# Altium project Audio_Moduloop_V2.PrjPcb
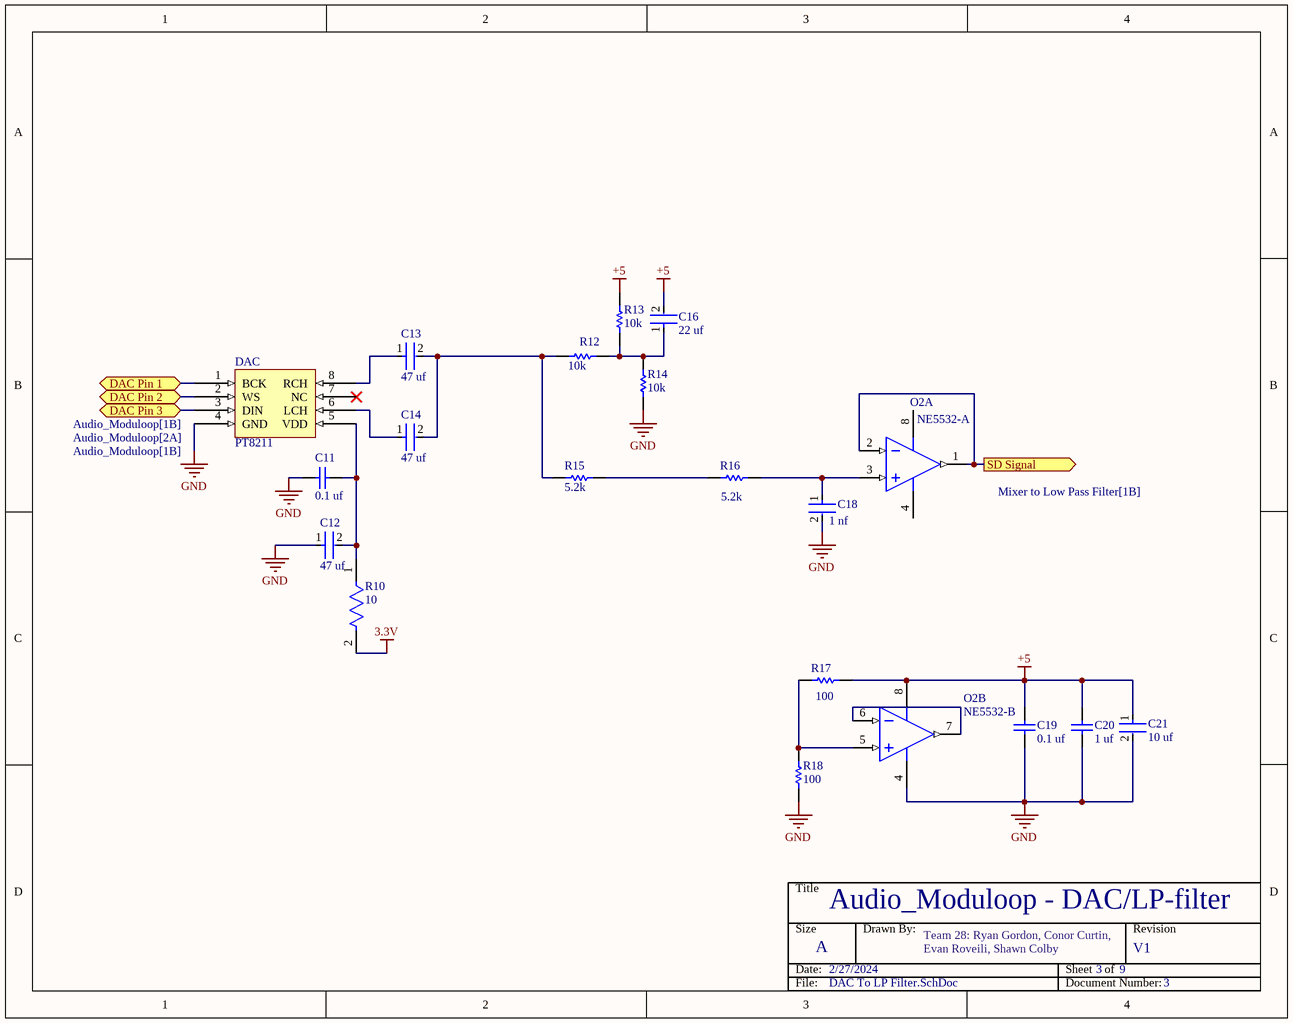
[diagram p0: DAC To LP Filter.SchDoc]
5 sheets, 83 parts. Net scope: flat (ports and power ports of the same name join across sheets).
Board file: Audio_PCB.PcbDoc
Sheets:
  DAC To LP Filter.SchDoc
  Mixer to Low Pass Filter.SchDoc
  High Pass Filter.SchDoc
  Amplifier-LM386.SchDoc
  Amplifier-TPA2016D2.SchDoc

## Sheet DAC To LP Filter.SchDoc: Audio_Moduloop - DAC/LP-filter
size A; Date: 2/27/2024; DrawnBy: Team 28: Ryan Gordon, Conor Curtin, Evan Roveili, Shawn Colby; DocumentNumber: 3; Revision: V1; SheetNumber: 3; SheetTotal: 9

### Parts
C11  0.1 uf  [VISH-K104K15X7RF5TL2]
C12  47 uf  [FP-RCE2A2-MFG]
C13  47 uf  [FP-RCE2A2-MFG]
C14  47 uf  [FP-RCE2A2-MFG]
C16  22 uf  [FP-RCEWM1-MFG]
C18  1 nf  [FP-RCE0DB-MFG]
C19  0.1 uf  [CAPC2013X135X45ML10T25]
C20  1 uf  [CAPC2013X145X50LL20T25]
C21  10 uf  [FP-C0805C-DG-MFG]
DAC  PT8211  [SOIC127P602X173-8N]
O2  NE5532-A  [ONSC-SOIC-8-751-07_V]  (parts A,B of 2)
R10  10  [FP-RN732A-MFG]
R12  10k  [RESC2013X60X35NL10T20]
R13  10k  [RESC2013X60X35NL10T20]
R14  10k  [RESC2013X60X35NL10T20]
R15  5.2k  [RESC2013X70X40LL20T20]
R16  5.2k  [RESC2013X70X40LL20T20]
R17  100  [RESC2013X60X40ML20T25]
R18  100  [RESC2013X60X40ML20T25]

### Ports
DAC Pin 1 (bidir, see Audio_Moduloop[1B]), DAC Pin 2 (bidir, see Audio_Moduloop[1B]), DAC Pin 3 (bidir, see Audio_Moduloop[2A]), SD Signal (out, see Mixer to Low Pass Filter[1B])

### Nets
3.3V: R10.2
+5: C16.2 C19.1 C20.1 C21.1 O2.8(V+) R13.1 R17.2
GND: C11.2 C12.1 C18.2 C19.2 C20.2 C21.2 DAC.4(GND) O2.4(V-) R14.2 R18.1
NetC11_1: C11.1 C12.2 DAC.5(VDD) R10.1
NetC13_1: C13.1 DAC.8(RCH)
NetC13_2: C13.2 C14.2 R12.2 R15.1
NetC14_1: C14.1 DAC.6(LCH)
NetC16_1: C16.1 R12.1 R13.2 R14.1
NetC18_1: C18.1 O2.3(INA+) R16.2
NetDAC_1: DAC.1(BCK) ; port DAC Pin 1
NetDAC_2: DAC.2(WS) ; port DAC Pin 2
NetDAC_3: DAC.3(DIN) ; port DAC Pin 3
NetO2_1: O2.1(OUTA) O2.2(INA-) ; port SD Signal
NetO2_5: O2.5(INB+) R17.1 R18.2
NetO2_6: O2.6(INB-) O2.7(OUTB)
NetR15_2: R15.2 R16.1

Not connected (* = marked no-connect by the designer): DAC 7(NC)*

### Notes on the sheet
- Title
- Size
- Date:
- A
- Drawn By:
- Sheet    of
- Revision
- File:
- Document Number:

### Library data of the parts
C11 = CMP-2000-06508-1: Ceramic Capacitor, 100 nF, +/- 10%, 50 V, -55 to 125 degC, 2-Pin THD, RoHS, Tape and Reel; Manufacturer: Vishay; Other Names: BC1084CT; Catalog Drawings: Mono-KapSide2-15_5.58Mono-KapSide1_15; Temperature Coefficient: X7R; Voltage - Rated: 50V; Online Catalog: Mono-Kap™Series; Capacitance: 0.1µF; Size / Dimension: 0.157"Lx0.098"W(4.00mmx2.50mm); Operating Temperature: -55°C~125°C; Family: CeramicCapacitors; Manufacturer URL: http://www.vishay.com/; Standard Package: 1; Thickness (Max): -; Ratings: -; Datasheet Version: 08/2013; Package Description: 2-Pin Through Hole Device, Body 4 x 2.6 mm; Mounting Type: ThroughHole; Features: -; Lead Spacing: 0.098"(2.50mm); Tolerance: ±10%; Category: Capacitors; Mounting Technology: ThroughHole; Lead Style: Straight; Datasheet URL: http://www.vishay.com/docs/45171/kseries.pdf; Applications: GeneralPurpose; Package / Case: Radial; Height - Seated (Max): 0.220"(5.58mm); Package Reference: K104K15X7RF5TL2; Series: Mono-Kap™K; Packaging: CutTape(CT)
C12-C14 = CMP-06035-022497-1: Cap Ceramic 4.7uF 25V X7R ±10% Radial 2.5mm +125°C Automotive Ammo Pack; Lead/Base Style: Straight; Lead Diameter: 0.5mm; Height - Seated (Max): 0.157inch; Voltage Rating (DC): 25V; Height: 4mm; Length: 0.217inch; Max Operating Temperature: 125°C; Ratings: AEC-Q200; Dielectric: X7R; Resistor Type: Ceramic; Packaging: Tape and Reel; Tolerance: 10%; Termination: Radial; Min Operating Temperature: -55°C; Case/Package: Radial; Width: 0.124inch; Lead Pitch: 0.098inch; Package Quantity: 2000; Voltage Rating: 25V; Mount: Through Hole; Capacitance: 4.7uF
C16 = CMP-06035-009422-1: Cap Ceramic 22uF 25V X7R ±20% Radial 5mm +125°C Automotive Ammo Pack; Lead/Base Style: Formed Leads; Lead Diameter: 0.5mm; Packaging: Bulk; Width: 0.157inch; Min Operating Temperature: -55°C; Lead Pitch: 0.197inch; Ratings: AEC-Q200; Length: 0.217inch; Voltage Rating (DC): 25V; Case/Package: Radial; Height - Seated (Max): 0.295inch; Package Quantity: 500; Max Operating Temperature: 125°C; Mount: Through Hole; Resistor Type: Ceramic; Height: 7.5mm; Capacitance: 22uF; Tolerance: 20%; Dielectric: X7R; Voltage Rating: 25V; Termination: Radial
C18 = CMP-06035-009321-1: Cap Ceramic 470pF 100V X7R ±10% Radial 2.5mm +125°C Ammo Pack; Lead Diameter: 0.5mm; Lead/Base Style: Straight; Termination: Radial; Width: 0.098inch; Mount: Through Hole; Package Quantity: 2000; Height - Seated (Max): 0.138inch; Height: 3.5mm; Voltage Rating: 100V; Min Operating Temperature: -55°C; Dielectric: X7R; Max Operating Temperature: 125°C; Voltage Rating (DC): 100V; Capacitance: 470pF; Ratings: AEC-Q200; Packaging: Tape and Reel; Tolerance: 10%; Resistor Type: Ceramic; Lead Pitch: 0.098inch; Case/Package: Radial; Length: 0.142inch
C19 = CMP-2100-03644-1: Chip Capacitor, 0.1 uF, +/- 10%, 50 V, -55 to 125 degC, 0805 (2012 Metric), RoHS, Tape and Reel; Manufacturer: Murata; Voltage: 50V; Capacitance: 100nF; Insulation Resistance: 10GR; Dielectric Material: Ceramic; Dielectric: X7R; Package Description: 2-Pin Surface Mount Device, Body 2 x 1.25 mm; Manufacturer URL: http://www.murata.com/; Case Code (Imperial): 0805; Datasheet URL: http://psearch.en.murata.com/capacitor/product/GRM21BR71H104KA01%23.pdf; Termination: SMD/SMT; Lead Free: LeadFree; Package Quantity: 1; Mount: SurfaceMount; REACH SVHC: Unknown; Thickness: 0.053inch; Height: 1.25mm; Case/Package: 0805; Voltage Rating: 50V; Width: 0.049inch; Case Code (Metric): 2012; Material: Ceramic; Min Operating Temperature: -55degC; RoHSCompliant: true; Datasheet Version: 42675.0; Voltage Rating (DC): 50V; Tolerance: 10%; Package Reference: 0805; Depth: 1.25mm; Length: 2mm; Max Operating Temperature: 125degC; Packaging: TapeandReel; Number of Pins: 2; Radiation Hardening: No
C20 = CMP-1036-04746-2: Manufacturer: Kemet; Part Number: C0805C105K4PACTU
C21 = CMP-2007-03243-2: CAP CER 10UF 10V X5R 0805; Manufacturer Part Number: C0805C106K8PACTU; Manufacturer: Kemet; 3DS Part Number: 220-00001; Tolerance: 10%; Temperature Coefficient: 15%; Material: Ceramic; Device Class L2: Capacitors; Device Class L1: Passive Components; ComponentLink2URL: https://content.kemet.com/datasheets/KEM_C1006_X5R_SMD.pdf; Height: 1.4mm; Lead Free: Yes; Digikey Description: CAP CER 10UF 10V X5R 0805; Octopart: https://octopart.com/c0805c106k8pactu-kemet-98697; Capacitance: 10uF; Value: 10uF; Temperature Range Low: -55°C; Temperature: -55°C to +85°C; Automotive: No; Mouser Description: CAP CER 10UF 10V X5R 0805; Ipc Land Pattern Name: CAPC200125X125; Temperature Range High: +85°C; Voltage: 10V; RoHS: TRUE; Device Class L3: Ceramic Capacitors; ComponentLink2Description: Datasheet; Voltage Rating: 10V; Package: C0805C-DG; Temperature Characteristic: X5R; Category: Cap
DAC = CMP-015-00008-3
O2 = CMP-1310-00252-1: Internally Compensated Dual Low Noise Operational Amplifier, 6 to 40 V, 0 to 70 degC, 8-Pin SOIC, Pb-Free, Tape and Reel; Manufacturer: On Semiconductor; PartNumber: NE5532AD8R2G; SR Typ (V/uS): 9; VCC Min (V): 6; VCC Max (V): 40; GBW Typ (MHz): 10; PackageVersion: Rev. AK, 02/2011; ComponentLink2URL: http://www.onsemi.cn/pub_link/Collateral/NE5532-D.PDF; RoHS: TRUE; PackageReference: SOIC-8-751-07; ComponentLink2Description: Datasheet; PackageDescription: 8-Pin Small Outline Integrated Circuit, Body 4.9 x 3.9 mm, Pitch 1.27 mm; ComponentLink3URL: http://www.onsemi.com/pub_link/Collateral/751-07.PDF; ComponentLink1Description: Manufacturer URL; DatasheetVersion: Rev. 2; Packing: Tape and Reel; ComponentLink1URL: http://www.onsemi.com/; ComponentLink3Description: Package Specification; Mounting Technology: Surface Mount
R10 = CMP-03211-004731-1: SMD Chip Resistor, Thin Film, 10Ω, 100 V, 0805 [2012 Metric], 100 mW, 0.1%, RN73 Series; Manufacturer: TE Connectivity; Manufacturer Part Number: RN73C2A10RBTG; Power Rating: 0.1W; Temperature Coefficient: 10ppm/°C; Voltage Rating: 100V; Device Class L2: Resistors; octopart_url: https://octopart.com/rn73c2a10rbtg-te+connectivity-21412009; Temperature: -55°C to 155°C; Automotive: No; Temperature Range High: 155°C; Device Class L1: Passive Components; Package: RN732A; Value: 10Ω; Lead Free: Yes; Composition: Thin Film; Ipc Land Pattern Name: RESC200125X55; Resistance: 10Ω; RoHS: TRUE; Height: 0.65mm; Series: RN73; Category: Res; ComponentLink2URL: https://www.te.com/commerce/DocumentDelivery/DDEController?Action=showdoc&DocId=Data+Sheet%7F1773270%7FP%7Fpdf%7FEnglish%7FENG_DS_1773270_P.pdf%7F1676162-2; Device Class L3: Chip SMD Resistors; Octopart: https://octopart.com/rn73c2a10rbtg-te+connectivity-21412009; ComponentLink2Description: Datasheet; Temperature Range Low: -55°C; packaging: 250 cut tape length; Tolerance: 0.1%
R12-R14 = CMP-1659-00013-4: Chip Resistor, 10 KOhm, +/- 1%, 0.125 W, -55 to 155 degC, 0805 (2012 Metric), RoHS, Tape and Reel; Manufacturer: Yageo; Voltage Rating: 150 V; Mount: Surface Mount; ComponentLink1Description: Manufacturer URL; ComponentLink2URL: http://www.yageo.com/documents/recent/PYu-RC_Group_51_RoHS_L_04.pdf; Pins: 2; Length: 2 mm; Min Operating Temperature: -55 degC; Height: 0.5 mm; Mounting Technology: Surface Mount; RoHSCompliant: true; REACH SVHC: No SVHC; ComponentLink1URL: http://www.yageo.com/; Max Operating Temperature: 155 degC; PackageReference: 0805; DatasheetVersion: Rev. 4, 02/2016; Package Quantity: 5000; Packaging: Tape and Reel; ComponentLink2Description: Datasheet; PackageDescription: 2-Pin Surface Mounted Device, Body 2 x 1.25 mm
R15 R16 = CMP-2001-00567-1: Manufacturer: Panasonic; Part Number: ERJ6ENF6801V
R17 R18 = CMP-2001-00580-1: Manufacturer: Panasonic; Part Number: ERA6AEB101V

## Sheet Mixer to Low Pass Filter.SchDoc: Audio_Moduloop - Mixer/Filters
size A; Date: 2/27/2024; DrawnBy: Team 28: Ryan Gordon, Conor Curtin, Evan Roveili, Shawn Colby; DocumentNumber: 4; Revision: V1; SheetNumber: 4; SheetTotal: 9
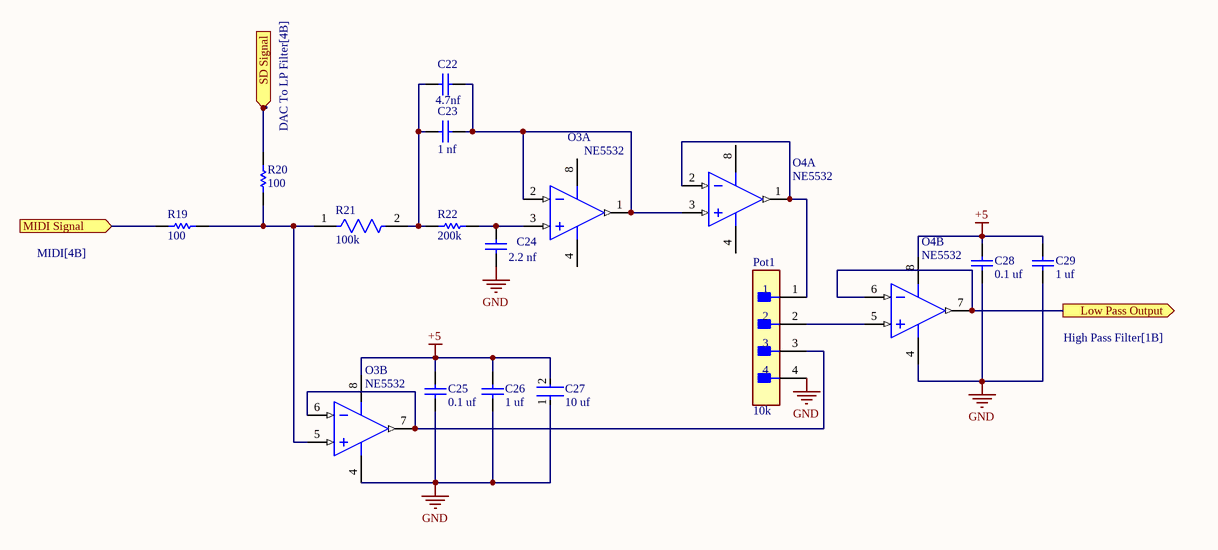
[diagram p1: Mixer to Low Pass Filter.SchDoc]

### Parts
C22  4.7nf  [AVX-SA115C104KAR]
C23  1 nf  [AVX-SA115C104KAR]
C24  2.2 nf  [AVX-SA115C104KAR]
C25  0.1 uf  [CAPC2013X135X45ML10T25]
C26  1 uf  [CAPC2013X145X50LL20T25]
C27  10 uf  [FP-C0805C-DG-MFG]
C28  0.1 uf  [CAPC2013X135X45ML10T25]
C29  1 uf  [CAPC2013X145X50LL20T25]
O3  NE5532  [ONSC-SOIC-8-751-07_V]  (parts A,B of 2)
O4  NE5532  [ONSC-SOIC-8-751-07_V]  (parts A,B of 2)
Pot1  10k  [FP-B4B-XH-A_LF_SN-MFG]
R19  100  [RESC2013X60X40ML20T25]
R20  100  [RESC2013X60X40ML20T25]
R21  100k  [FP-RC0805-0_6-IPC_C]
R22  200k  [RESC2013X60X40LL20T25]

### Ports
Low Pass Output (out, see High Pass Filter[1B]), MIDI Signal (in, see MIDI[4B]), SD Signal (in, see DAC To LP Filter[4B])

### Nets
+5: C25.1 C26.1 C27.2 C28.1 C29.1 O3.8(V+) O4.8(V+)
GND: C24.1 C25.2 C26.2 C27.1 C28.2 C29.2 O3.4(V-) O4.4(V-) Pot1.4
NetC22_1: C22.1 C23.1 R21.2 R22.1
NetC22_2: C22.2 C23.2 O3.1(OUTA) O3.2(INA-) O4.3(INA+)
NetC24_2: C24.2 O3.3(INA+) R22.2
NetC30_2: O4.6(INB-) O4.7(OUTB) ; port Low Pass Output
NetO2_1: R20.1 ; port SD Signal
NetO3_5: O3.5(INB+) R19.2 R20.2 R21.1
NetO3_6: O3.6(INB-) O3.7(OUTB) Pot1.3
NetO4_1: O4.1(OUTA) O4.2(INA-) Pot1.1
NetO4_5: O4.5(INB+) Pot1.2
NetR19_1: R19.1 ; port MIDI Signal

### Notes on the sheet
- Title
- Size
- Date:
- A
- Drawn By:
- Sheet    of
- Revision
- File:
- Document Number:

### Library data of the parts
C22-C24 = CMP-2000-07029-1: Axial Leads / SpinGuard(R), Ceramic Capacitor, 0.10 uF +/- 10%, 50V, -55 to 125 degC, 2-Pin THD, RoHS, Tape and Reel; Manufacturer: AVX; Other Names: 478-3151-1; Catalog Drawings: SASeries_4.32x3.05; Capacitance: 0.1µF; Temperature Coefficient: X7R; Online Catalog: SpinGuard®SASeries; Product Training Modules: ComponentSolutionsforSmartMeterApplications; Category: Capacitors; Package Description: 2-Pin Axial Lead, Dia 3.05 mm, Body Length 4.32 mm; Standard Package: 1; Mounting Technology: ThroughHole; Ratings: -; Datasheet Version: 06/2007; Voltage - Rated: 50V; Tolerance: ±10%; Package Reference: SA115C104KAR; Packaging: -; Lead Style: -; Size / Dimension: 0.120"Diax0.170"L(3.05mmx4.32mm); Mounting Type: ThroughHole; Operating Temperature: -55°C~125°C; Datasheet URL: https://datasheet.ciiva.com/27051/1074183-27051369.pdf; Applications: GeneralPurpose; Thickness (Max): -; Lead Spacing: -; Height - Seated (Max): -; Family: CeramicCapacitors; Package / Case: Axial; Features: -; Series: SpinGuard®SA; Manufacturer URL: http://www.avx.com/
C25 C28 = CMP-2100-03644-1: as C19 on sheet DAC To LP Filter; Package Description: 2-Pin Surface Mount Device, Body 2 x 1.25 mm; Manufacturer URL: http://www.murata.com/; Case Code (Imperial): 0805; Datasheet URL: http://psearch.en.murata.com/capacitor/product/GRM21BR71H104KA01%23.pdf; Termination: SMD/SMT; Lead Free: LeadFree; Package Quantity: 1; Mount: SurfaceMount; REACH SVHC: Unknown; Thickness: 0.053inch; Height: 1.25mm; Case/Package: 0805; Voltage Rating: 50V; Width: 0.049inch; Case Code (Metric): 2012; Material: Ceramic; Min Operating Temperature: -55degC; RoHSCompliant: true; Datasheet Version: 42675.0; Voltage Rating (DC): 50V; Tolerance: 10%; Package Reference: 0805; Depth: 1.25mm; Length: 2mm; Max Operating Temperature: 125degC; Packaging: TapeandReel; Number of Pins: 2; Radiation Hardening: No
C26 C29 = CMP-1036-04746-2: as C20 on sheet DAC To LP Filter
C27 = CMP-2007-03243-2: as C21 on sheet DAC To LP Filter; Device Class L2: Capacitors; Device Class L1: Passive Components; ComponentLink2URL: https://content.kemet.com/datasheets/KEM_C1006_X5R_SMD.pdf; Height: 1.4mm; Lead Free: Yes; Digikey Description: CAP CER 10UF 10V X5R 0805; Octopart: https://octopart.com/c0805c106k8pactu-kemet-98697; Capacitance: 10uF; Value: 10uF; Temperature Range Low: -55°C; Temperature: -55°C to +85°C; Automotive: No; Mouser Description: CAP CER 10UF 10V X5R 0805; Ipc Land Pattern Name: CAPC200125X125; Temperature Range High: +85°C; Voltage: 10V; RoHS: TRUE; Device Class L3: Ceramic Capacitors; ComponentLink2Description: Datasheet; Voltage Rating: 10V; Package: C0805C-DG; Temperature Characteristic: X5R; Category: Cap
O3 O4 = CMP-1310-00252-1: as O2 on sheet DAC To LP Filter; PackageVersion: Rev. AK, 02/2011; ComponentLink2URL: http://www.onsemi.cn/pub_link/Collateral/NE5532-D.PDF; RoHS: TRUE; PackageReference: SOIC-8-751-07; ComponentLink2Description: Datasheet; PackageDescription: 8-Pin Small Outline Integrated Circuit, Body 4.9 x 3.9 mm, Pitch 1.27 mm; ComponentLink3URL: http://www.onsemi.com/pub_link/Collateral/751-07.PDF; ComponentLink1Description: Manufacturer URL; DatasheetVersion: Rev. 2; Packing: Tape and Reel; ComponentLink1URL: http://www.onsemi.com/; ComponentLink3Description: Package Specification; Mounting Technology: Surface Mount
Pot1 = CMP-17439-000250-1: CONN HEADER VERT 4POS 2.5MM; Number of Contacts: 4; Contact Resistance: 20mR; Voltage Rating: 250V; Max Current Rating: 3A; Gender: Male; Wire/Cable Gauge: 22AWG; Mated Stacking Heights: 9.8mm; Insulation Resistance: 1GR; Orientation: Straight; Contact Type: Male Pin; Contact Finish - Mating: TIN; Series: XH; Max Voltage Rating (AC): 250V; Lead Pitch: 2.5mm; Contact Shape: Square; Insulation Color: Natural; Termination: Solder; Lead Free: Lead Free; Voltage Rating (AC): 250V; Number of Rows: 1; Flammability Rating: UL94 V-0; Number of Positions: 4; Max Operating Temperature: 85°C; Package Quantity: 500; Mount: Through Hole; REACH SVHC: No SVHC; Connector Type: Header; Insulation Material: Nylon; Fastening Type: Detent; Min Operating Temperature: -25°C; Housing Color: White; Packaging: Bulk; Contact Plating: Tin; Contact Material: Brass; Max Voltage Rating (DC): 250V; Housing Material: Polyamide; Color: Natural; Material: Polyamide; Pitch: 2.5mm; Depth: 5.75mm; Current Rating: 3A; Length: 12.4mm
R19 R20 = CMP-2001-00580-1: as R17 on sheet DAC To LP Filter
R21 = CMP-2100-03668-5: RES 100K OHM 1% 1/8W 0805; Power Rating: 125mW; Temperature Coefficient: 100ppm/°C; Voltage Rating (DC): 150V; Resistance: 100kR; Package Quantity: 1; Case/Package: 0805; Lead Pitch: 0.4mm; Case Code (Imperial): 0805; Construction: Rectangular; Number of Terminations: 2; RoHS Compliant: Yes; Max Power Dissipation: 125mW; Tolerance: 1%; Max Operating Temperature: 155°C; Resistance Tolerance: 1%; Lead Free: Lead Free; Packaging: Tape and Reel; Resistor Type: Thick Film; Min Operating Temperature: -55°C; Case Code (Metric): 2012; Series: RC; Technology: THICK FILM; Voltage Rating: 150V; Termination: SMD/SMT; Width: 0.049inch; Number of Pins: 2; Features: Moisture Resistant; Military Standard: Not; Length: 0.079inch; Depth: 1.25mm; Size Code: 0805; Height: 0.024inch
R22 = CMP-2001-00611-1: Part Number: ERA6AEB204V; Manufacturer: Panasonic

## Sheet High Pass Filter.SchDoc: High Pass Filter
size A; DocumentNumber: 5; SheetNumber: 5; SheetTotal: 9
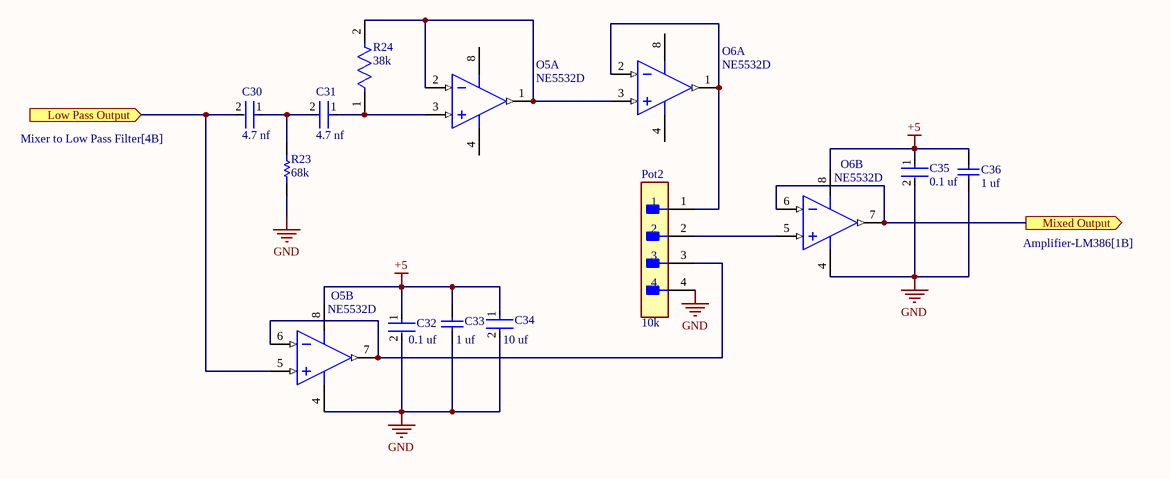
[diagram p2: High Pass Filter.SchDoc]

### Parts
C30  4.7 nf  [FP-RCEWM1-MFG]
C31  4.7 nf  [FP-RCEWM1-MFG]
C32  0.1 uf  [FP-CL21-IPC_A]
C33  1 uf  [CAPC2013X145X50LL20T25]
C34  10 uf  [FP-C0805C-DG-MFG]
C35  0.1 uf  [FP-CL21-IPC_A]
C36  1 uf  [CAPC2013X145X50LL20T25]
O5  NE5532D  [D0008A_L]  (parts A,B of 2)
O6  NE5532D  [D0008A_L]  (parts A,B of 2)
Pot2  10k  [FP-B4B-XH-A_LF_SN-MFG]
R23  68k  [RESC2013X70X40LL20T20]
R24  38k  [FP-ERJ6EN-MFG]

### Ports
Low Pass Output (in, see Mixer to Low Pass Filter[4B]), Mixed Output (out, see Amplifier-LM386[1B])

### Nets
+5: C32.1 C33.1 C34.1 C35.1 C36.1 O5.8(VCC+) O6.8(VCC+)
GND: C32.2 C33.2 C34.2 C35.2 C36.2 O5.4(VCC-) O6.4(VCC-) Pot2.4 R23.2
NetC30_1: C30.1 C31.2 R23.1
NetC30_2: C30.2 O5.5(IN2+) ; port Low Pass Output
NetC31_1: C31.1 O5.3(IN1+) R24.1
NetO5_1: O5.1(OUT1) O5.2(IN1-) O6.3(IN1+) R24.2
NetO5_6: O5.6(IN2-) O5.7(OUT2) Pot2.3
NetO6_1: O6.1(OUT1) O6.2(IN1-) Pot2.1
NetO6_5: O6.5(IN2+) Pot2.2
NetO6_6: O6.6(IN2-) O6.7(OUT2) ; port Mixed Output

### Notes on the sheet
- Title
- Size
- Date:
- A
- Drawn By:
- Sheet    of
- Revision
- File:
- Document Number:

### Library data of the parts
C30 C31 = CMP-06035-003622-1: CAP CER 22UF 25V X7R RADIAL; Tolerance: 20%; Lead Diameter: 0.5mm; Lead/Base Style: Formed Leads; Height - Seated (Max): 0.295inch; Height: 7.5mm; Capacitance: 22uF; Max Operating Temperature: 125°C; Package Quantity: 1500; Case/Package: Radial; Length: 0.217inch; Lead Pitch: 0.197inch; Voltage Rating (DC): 25V; Ratings: AEC-Q200; Mount: Through Hole; Packaging: Tape and Reel; Voltage Rating: 25V; Min Operating Temperature: -55°C; Width: 0.157inch; Resistor Type: Ceramic; Termination: Radial; Dielectric: X7R
C32 C35 = CMP-13271-003098-1: CL21 Series 0805 1uF 16V ±10% Tolerance X7R Multilayer Ceramic Chip Capacitor; Case Code (Metric): 2012; Width: 0.049inch; Thickness: 0.053inch; Voltage Rating: 16V; Max Operating Temperature: 125°C; Case Code (Imperial): 0805; Height: 1.25mm; Length: 2mm; Case/Package: 0805; Lead Free: Lead Free; Mount: Surface Mount; Capacitance: 1uF; Tolerance: 10%; Voltage Rating (DC): 16V; Min Operating Temperature: -55°C; Contact Plating: Tin; Depth: 1.25mm; Packaging: Tape and Reel; Package Quantity: 1; Voltage: 16V; Dielectric: X7R; Radiation Hardening: No
C33 C36 = CMP-1036-04746-2: as C20 on sheet DAC To LP Filter
C34 = CMP-2007-03243-2: as C21 on sheet DAC To LP Filter; Device Class L2: Capacitors; Device Class L1: Passive Components; ComponentLink2URL: https://content.kemet.com/datasheets/KEM_C1006_X5R_SMD.pdf; Height: 1.4mm; Lead Free: Yes; Digikey Description: CAP CER 10UF 10V X5R 0805; Octopart: https://octopart.com/c0805c106k8pactu-kemet-98697; Capacitance: 10uF; Value: 10uF; Temperature Range Low: -55°C; Temperature: -55°C to +85°C; Automotive: No; Mouser Description: CAP CER 10UF 10V X5R 0805; Ipc Land Pattern Name: CAPC200125X125; Temperature Range High: +85°C; Voltage: 10V; RoHS: TRUE; Device Class L3: Ceramic Capacitors; ComponentLink2Description: Datasheet; Voltage Rating: 10V; Package: C0805C-DG; Temperature Characteristic: X5R; Category: Cap
O5 O6 = CMP-0015-00060-2: Dual Low-Noise High-Speed Audio Operational Amplifier, 10 to 30 V, 0 to 70 degC, 8-pin SOIC (D8), Green (RoHS & no Sb/Br); Manufacturer: Texas Instruments; GBW(Typ)(MHz): 10; Vn at 1kHz(Typ)(nV/rtHz): 5; Number of Channels: 2; Vio (25C)(Max)(mV): 4; Slew Rate(Typ)(V/us): 9; Sub Family: General Purpose Amplifier, High Supply Voltage Amplifier (>=30V), Low Noise Amp (<=10nV/rtHz); CMRR(Min)(dB): 70; Total Supply Voltage(Max)(+5V is 5, +/-5V is 10): 30; IIB(Max)(pA): 800000; ComponentLink1Description: Manufacturer URL; PackageReference: D0008A; ComponentLink1URL: http://www.ti.com/; DatasheetVersion: SLOS075I; PackageDescription: 8-Pin Plastic Small Outline, Body 4.9 x 3.9 mm, Pitch 1.27 mm; PackageVersion: 4040047-3/M, 06/2011; ComponentLink3Description: Package Specification; PartNumber: NE5532D; ComponentLink3URL: http://www.ti.com/litv/pdf/msoi002j; Iq per channel(Max)(mA): 4; Eco-Plan: Green (RoHS & no Sb/Br); ComponentLink2Description: Datasheet; Code_JEDEC: MS-012; Total Supply Voltage(Min)(+5V is 5, +/-5V is 10): 10; Mounting Technology: Surface Mount; ComponentLink2URL: http://www.ti.com/lit/ds/symlink/ne5532.pdf
Pot2 = CMP-17439-000250-1: as Pot1 on sheet Mixer to Low Pass Filter; Orientation: Straight; Contact Type: Male Pin; Contact Finish - Mating: TIN; Series: XH; Max Voltage Rating (AC): 250V; Lead Pitch: 2.5mm; Contact Shape: Square; Insulation Color: Natural; Termination: Solder; Lead Free: Lead Free; Voltage Rating (AC): 250V; Number of Rows: 1; Flammability Rating: UL94 V-0; Number of Positions: 4; Max Operating Temperature: 85°C; Package Quantity: 500; Mount: Through Hole; REACH SVHC: No SVHC; Connector Type: Header; Insulation Material: Nylon; Fastening Type: Detent; Min Operating Temperature: -25°C; Housing Color: White; Packaging: Bulk; Contact Plating: Tin; Contact Material: Brass; Max Voltage Rating (DC): 250V; Housing Material: Polyamide; Color: Natural; Material: Polyamide; Pitch: 2.5mm; Depth: 5.75mm; Current Rating: 3A; Length: 12.4mm
R23 = CMP-2001-00442-1: Manufacturer: Panasonic; Part Number: ERJ-6GEYJ683V
R24 = CMP-2001-00027-2: RES SMD 20K OHM 1% 1/8W 0805; Temperature Coefficient: 100ppm/°C; Voltage Rating: 150V; Power Rating: 125mW; Resistance: 20kR; Max Operating Temperature: 155°C; Number of Terminations: 2; RoHS Compliant: Yes; Case Code (Imperial): 0805; Packaging: Tape and Reel; Construction: Rectangular; Series: ERJ; Resistor Type: Thick Film; Lead Free: Lead Free; Package Quantity: 1; Case/Package: 0805; Features: Automotive AEC-Q200; REACH SVHC: No SVHC; Technology: THICK FILM; Width: 0.049inch; Length: 2mm; Depth: 1.25mm; Min Operating Temperature: -55°C; Case Code (Metric): 2012; Contact Plating: Tin; Termination: SMD/SMT; Resistance Tolerance: 1%; Height: 0.6mm; Working Voltage: 150V; Military Standard: Not; Max Power Dissipation: 125mW; Radiation Hardening: No; Tolerance: 1%; Voltage Rating (DC): 150V; Mount: Surface Mount

## Sheet Amplifier-LM386.SchDoc: Audio_Moduloop - Amplifier
size A; Date: 2/27/2024; DrawnBy: Team 28: Ryan Gordon, Conor Curtin, Evan Roveili, Shawn Colby; DocumentNumber: 6; Revision: V1; SheetNumber: 6; SheetTotal: 9
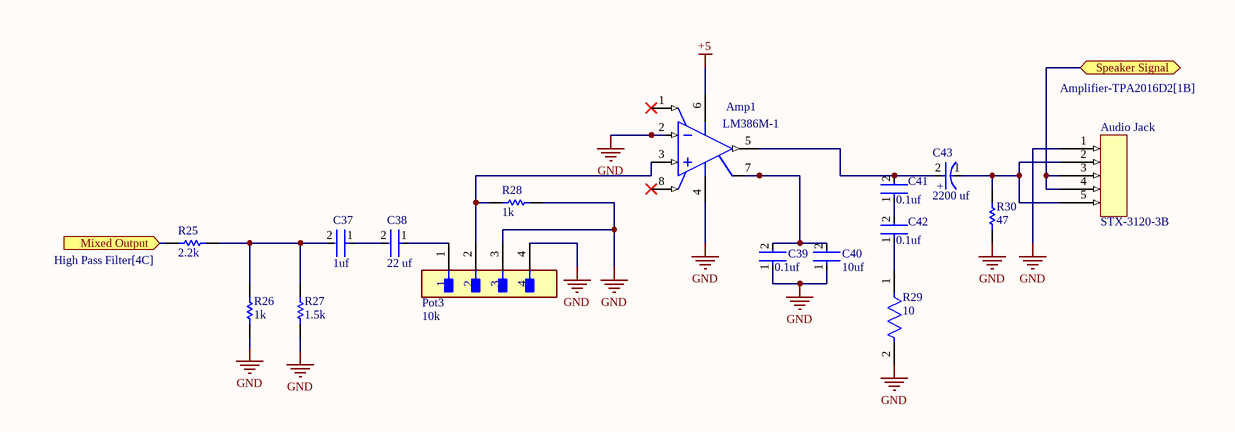
[diagram p3: Amplifier-LM386.SchDoc]

### Parts
Amp1  LM386M-1  [TI-D8_M]
Audio_Jack  STX-3120-3B  [STX3100]
C37  1uf  [FP-K105Z20Y5VF5TL2-MFG]
C38  22 uf  [FP-RCEWM1-MFG]
C39  0.1uf  [FP-SR20-MFG]
C40  10uf  [FP-RCE3DB-MFG]
C41  0.1uf  [FP-SR20-MFG]
C42  0.1uf  [FP-SR20-MFG]
C43  2200 uf  [FP-RAD-TH-D_10_0_5-L_16_1-MFG]
Pot3  10k  [FP-B4B-XH-A_LF_SN-MFG]
R25  2.2k  [RESC2013X60X40LL20T25]
R26  1k  [RESC2013X70X40ML20T20]
R27  1.5k  [RESC2013X60X40LL20T25]
R28  1k  [RESC2013X70X40ML20T20]
R29  10  [FP-RN732A-MFG]
R30  47  [RESC2013X60X40ML20T25]

### Ports
Mixed Output (in, see High Pass Filter[4C]), Speaker Signal (bidir, see Amplifier-TPA2016D2[1B])

### Nets
+5: Amp1.6(VS)
GND: Amp1.2(IN-) Amp1.4(GND) Audio_Jack.1 C39.1 C40.1 Pot3.3 Pot3.4 R26.1 R27.1 R28.2 R29.2 R30.1
NetAmp1_3: Amp1.3(IN+) Pot3.2 R28.1
NetAmp1_5: Amp1.5(VOUT) C41.2 C43.2(A)
NetAmp1_7: Amp1.7(BYPASS) C39.2 C40.2
NetAudio_Jack_2: Audio_Jack.2 Audio_Jack.5 C43.1(C) R30.2
NetAudio_Jack_3: Audio_Jack.3 Audio_Jack.4 ; port Speaker Signal
NetC37_1: C37.1 C38.2
NetC37_2: C37.2 R25.1 R26.2 R27.2
NetC38_1: C38.1 Pot3.1
NetC41_1: C41.1 C42.2
NetC42_1: C42.1 R29.1
NetO6_6: R25.2 ; port Mixed Output

Not connected (* = marked no-connect by the designer): Amp1 1(GAIN)* 8(GAIN)*

### Notes on the sheet
- Title
- Size
- Date:
- A
- Drawn By:
- Sheet    of
- Revision
- File:
- Document Number:
- (in symbol CMP-05427-000403-1) +

### Library data of the parts
Amp1 = CMP-0994-00001-1: Low Voltage Audio Power Amplifier, 0 to 70 degC, 8-pin SOIC (D8), Green (RoHS & no Sb/Br); PartNumber: LM386M-1/NOPB; Manufacturer: Texas Instruments; Input Type: Analog; SubFamily: Mid/High-Power Amplifier; Max. Number of Speaker Outputs: 1; PackageVersion: 4040047-3/M, 06/2011; ComponentLink2Description: Datasheet; DatasheetVersion: SNAS545A; ComponentLink3URL: http://www.ti.com/litv/pdf/msoi002j; ComponentLink1URL: http://www.ti.com/; Mounting Technology: Surface Mount; Eco-Plan: Green (RoHS & no Sb/Br); ComponentLink3Description: Package Specification; ComponentLink2URL: http://www.ti.com/general/docs/lit/getliterature.tsp?genericPartNumber=LM386&fileType=pdf; PackageDescription: 8-Pin Plastic Small Outline, Body 4.9 x 3.9 mm, Pitch 1.27 mm; ComponentLink1Description: Manufacturer URL; Code_JEDEC: MS-012; PackageReference: D8
Audio_Jack = CMP-00027-00002-2: 3 Pole(s), Female, Solder Terminal, Locking, Jack; Min Operating Temperature: -25°C; Mounting Technology: Board; Max Operating Temperature: 85°C; RoHS Compliant: Yes
C37 = CMP-02417-000003-1: CAP CER 1UF 50V Y5V RADIAL; Manufacturer Part Number: K105Z20Y5VF5TL2; Manufacturer: Vishay BC Components; Tolerance: -20+80%; Material: Ceramic; Capacitance: 1uF; Temperature Characteristic: Y5V; Mouser Description: Multilayer Ceramic Capacitors MLCC - Leaded 1uF 50volts +80/-20% Y5V 2.5mm LS; Lead Free: Yes; RoHS: TRUE; Voltage Rating: 50V; Device Class L1: Passive Components; Octopart: https://octopart.com/k105z20y5vf5tl2-vishay-39475252; Temperature Range Low: -30°C; Digikey Description: CAP CER 1UF 50V Y5V RADIAL; Device Class L2: Capacitors; Temperature: -30°C to +85°C; Package: K105Z20Y5VF5TL2; Temperature Range High: +85°C; ComponentLink2Description: Datasheet; Value: 1uF; Category: Cap; Height: 6.6mm; ComponentLink2URL: https://www.vishay.com/docs/45171/kseries.pdf; Device Class L3: Ceramic Capacitors; Automotive: No
C38 = CMP-06035-003622-1: as C30 on sheet High Pass Filter; Height - Seated (Max): 0.295inch; Height: 7.5mm; Capacitance: 22uF; Max Operating Temperature: 125°C; Package Quantity: 1500; Case/Package: Radial; Length: 0.217inch; Lead Pitch: 0.197inch; Voltage Rating (DC): 25V; Ratings: AEC-Q200; Mount: Through Hole; Packaging: Tape and Reel; Voltage Rating: 25V; Min Operating Temperature: -55°C; Width: 0.157inch; Resistor Type: Ceramic; Termination: Radial; Dielectric: X7R
C39 C41 C42 = CMP-04427-000013-1: CAP CER 0.1UF 50V X7R RADIAL; Manufacturer Part Number: SR205C104KAR; Manufacturer: AVX; Material: Ceramic; Tolerance: 10%; Capacitance: 100nF; Value: 100nF; Voltage: 50V; Height: 5.08mm; Digikey Description: CAP CER 0.1UF 50V X7R RADIAL; Device Class L2: Capacitors; ComponentLink2URL: http://datasheets.avx.com/SR-Series.pdf; Temperature Range High: +125°C; Lead Free: Yes; Category: Cap; Device Class L1: Passive Components; Temperature: -55°C to +125°C; Voltage Rating: 50V; ComponentLink2Description: Datasheet; RoHS: TRUE; Automotive: No; Octopart: https://octopart.com/sr205c104kar-avx-145048; Mouser Description: Multilayer Ceramic Capacitors MLCC - Leaded 50volts 0.1uF 10% X7R; Temperature Characteristic: X7R; Device Class L3: Ceramic Capacitors; Temperature Range Low: -55°C; Package: SR20
C40 = CMP-06035-005830-1: Cap Ceramic 10uF 25V X7R ±10% Radial 2.5mm +125°C Automotive Ammo Pack; Lead/Base Style: Straight; Lead Diameter: 0.5mm; Case/Package: Radial; Voltage Rating (DC): 25V; Tolerance: 10%; Lead Pitch: 0.098inch; Termination: Radial; Height - Seated (Max): 0.197inch; Resistor Type: Ceramic; Min Operating Temperature: -55°C; Dielectric: X7R; Length: 0.217inch; Voltage Rating: 25V; Width: 0.157inch; Height: 5mm; Packaging: Tape and Reel; Ratings: AEC-Q200; Max Operating Temperature: 125°C; Package Quantity: 1500; Mount: Through Hole; Capacitance: 10uF
C43 = CMP-05427-000403-1: Aluminum Electrolytic Capacitors (Radial Lead Type) 220uF ±20% 50V; ESR (Equivalent Series Resistance): 30mR; Ripple Current: 1.65A; Lead Diameter: 0.6mm; Life (Hours): 8000Hour; Height: 16mm; Min Operating Temperature: -40°C; Lead Pitch: 5mm; Diameter: 10mm; Features: General Purpose; Tolerance: 20%; Mount: Through Hole; Number of Pins: 2; Series: FR; Max Operating Temperature: 105°C; Contact Plating: Tin; Impedance: 30mR; Length: 16mm; Package Quantity: 1; RoHS Compliant: Yes; Lead Free: Lead Free; Voltage Rating: 50V; Packaging: Ammo Pack; Radiation Hardening: No; Termination: Radial; Voltage Rating (DC): 50V; Case/Package: Radial; Capacitance: 220uF; REACH SVHC: No SVHC; Height - Seated (Max): 0.689inch
Pot3 = CMP-17439-000250-1: as Pot1 on sheet Mixer to Low Pass Filter; Orientation: Straight; Contact Type: Male Pin; Contact Finish - Mating: TIN; Series: XH; Max Voltage Rating (AC): 250V; Lead Pitch: 2.5mm; Contact Shape: Square; Insulation Color: Natural; Termination: Solder; Lead Free: Lead Free; Voltage Rating (AC): 250V; Number of Rows: 1; Flammability Rating: UL94 V-0; Number of Positions: 4; Max Operating Temperature: 85°C; Package Quantity: 500; Mount: Through Hole; REACH SVHC: No SVHC; Connector Type: Header; Insulation Material: Nylon; Fastening Type: Detent; Min Operating Temperature: -25°C; Housing Color: White; Packaging: Bulk; Contact Plating: Tin; Contact Material: Brass; Max Voltage Rating (DC): 250V; Housing Material: Polyamide; Color: Natural; Material: Polyamide; Pitch: 2.5mm; Depth: 5.75mm; Current Rating: 3A; Length: 12.4mm
R25 = CMP-2001-00613-1: Manufacturer: Panasonic; Part Number: ERA6AEB222V
R26 R28 = CMP-2001-04375-5: Chip Resistor, 1 KOhm, +/- 1%, 0.125 W, -55 to 155 degC, 0805 (2012 Metric), RoHS, Tape and Reel; Manufacturer: Panasonic; Voltage Rating: 150 V; ComponentLink1URL: http://www.panasonic.com/; ComponentLink2Description: Datasheet; REACH SVHC: Yes; ComponentLink1Description: Manufacturer URL; Length: 2 mm; Height: 0.6 mm; Package Quantity: 1; PackageDescription: 2-Pin Surface Mount Device, Body 2 x 1.25 mm; Packaging: Cut Tape; PackageReference: 0805; Max Operating Temperature: 155 degC; Mounting Technology: Surface Mount; ComponentLink2URL: http://industrial.panasonic.com/cdbs/www-data/pdf/RDA0000/AOA0000C86.pdf; DatasheetVersion: 04/2015; Min Operating Temperature: -55 degC; RoHSCompliant: true; Mount: Surface Mount
R27 = CMP-2001-00597-1: Manufacturer: Panasonic; Part Number: ERA6AEB152V
R29 = CMP-03211-004731-1: as R10 on sheet DAC To LP Filter; Device Class L2: Resistors; octopart_url: https://octopart.com/rn73c2a10rbtg-te+connectivity-21412009; Temperature: -55°C to 155°C; Automotive: No; Temperature Range High: 155°C; Device Class L1: Passive Components; Package: RN732A; Value: 10Ω; Lead Free: Yes; Composition: Thin Film; Ipc Land Pattern Name: RESC200125X55; Resistance: 10Ω; RoHS: TRUE; Height: 0.65mm; Series: RN73; Category: Res; ComponentLink2URL: https://www.te.com/commerce/DocumentDelivery/DDEController?Action=showdoc&DocId=Data+Sheet%7F1773270%7FP%7Fpdf%7FEnglish%7FENG_DS_1773270_P.pdf%7F1676162-2; Device Class L3: Chip SMD Resistors; Octopart: https://octopart.com/rn73c2a10rbtg-te+connectivity-21412009; ComponentLink2Description: Datasheet; Temperature Range Low: -55°C; packaging: 250 cut tape length; Tolerance: 0.1%
R30 = CMP-2001-00642-1: Manufacturer: Panasonic; Part Number: ERA6AEB470V

## Sheet Amplifier-TPA2016D2.SchDoc: Speaker Amplifier
size A; DocumentNumber: 7; SheetNumber: 7; SheetTotal: 9
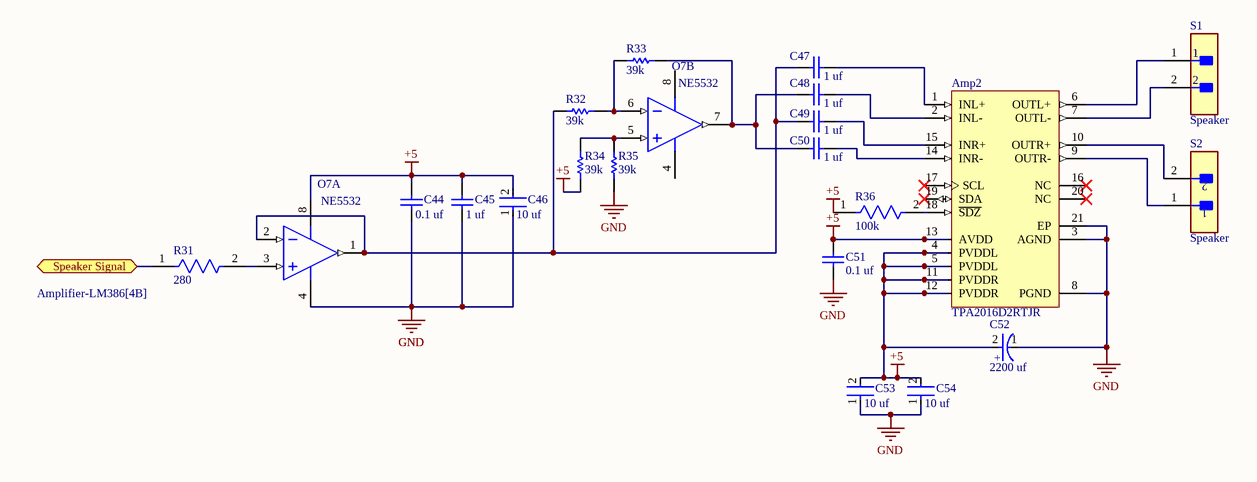
[diagram p4: Amplifier-TPA2016D2.SchDoc]

### Parts
Amp2  TPA2016D2RTJR  [RTJ0020D_V]
C44  0.1 uf  [CAPC2013X135X45ML10T25]
C45  1 uf  [CAPC2013X145X50LL20T25]
C46  10 uf  [FP-C0805C-DG-MFG]
C47  1 uf  [CAPC2013X135X45ML10T25]
C48  1 uf  [CAPC2013X135X45ML10T25]
C49  1 uf  [CAPC2013X135X45ML10T25]
C50  1 uf  [CAPC2013X135X45ML10T25]
C51  0.1 uf  [CAPC2013X135X45ML10T25]
C52  2200 uf  [FP-RAD-TH-D_10_0_5-L_16_1-MFG]
C53  10 uf  [FP-C0805C-DG-MFG]
C54  10 uf  [FP-C0805C-DG-MFG]
O7  NE5532  [ONSC-SOIC-8-751-07_V]  (parts A,B of 2)
R31  280  [FP-CRCW0805-e3-MFG]
R32  39k  [RESC2013X70X40NL20T20]
R33  39k  [RESC2013X70X40NL20T20]
R34  39k  [RESC2013X70X40NL20T20]
R35  39k  [RESC2013X70X40NL20T20]
R36  100k  [FP-RC0805-0_6-IPC_C]
S1  Speaker  [FP-B2B-XH-A_LF_SN-MFG]
S2  Speaker  [FP-B2B-XH-A_LF_SN-MFG]

### Ports
Speaker Signal (bidir, see Amplifier-LM386[4B])

### Nets
+5: Amp2.4(PVDDL) Amp2.5(PVDDL) Amp2.11(PVDDR) Amp2.12(PVDDR) Amp2.13(AVDD) C44.2 C45.1 C46.2 C51.2 C52.2(A) C53.2 C54.2 O7.8(V+) R34.1 R36.1
GND: Amp2.3(AGND) Amp2.8(PGND) Amp2.21(EP) C44.1 C45.2 C46.1 C51.1 C52.1(C) C53.1 C54.1 O7.4(V-) R35.1
NetAmp2_1: Amp2.1(INL+) C47.2
NetAmp2_2: Amp2.2(INL-) C48.2
NetAmp2_6: Amp2.6(OUTL+) S1.1
NetAmp2_7: Amp2.7(OUTL-) S1.2
NetAmp2_9: Amp2.9(OUTR-) S2.1
NetAmp2_10: Amp2.10(OUTR+) S2.2
NetAmp2_14: Amp2.14(INR-) C50.2
NetAmp2_15: Amp2.15(INR+) C49.2
NetAmp2_18: Amp2.18(~{SDZ}) R36.2
NetAudio_Jack_3: R31.1 ; port Speaker Signal
NetC47_1: C47.1 C49.1 O7.1(OUTA) O7.2(INA-) R32.1
NetC48_1: C48.1 C50.1 O7.7(OUTB) R33.2
NetO7_3: O7.3(INA+) R31.2
NetO7_5: O7.5(INB+) R34.2 R35.2
NetO7_6: O7.6(INB-) R32.2 R33.1

Not connected (* = marked no-connect by the designer): Amp2 16(NC)* 17(SCL)* 19(SDA)* 20(NC)*

### Notes on the sheet
- Title
- Size
- Date:
- A
- Drawn By:
- Sheet    of
- Revision
- File:
- Document Number:
- (in symbol CMP-05427-000639-1) +

### Library data of the parts
Amp2 = CMP-0991-00196-2: 2.8-W/Ch Stereo Class-D Audio Amplifier with SmartGainTM AGC / DRC, -40 to 85 degC, 20-pin QFN (RTJ20), Green (RoHS & no Sb/Br); Manufacturer: Texas Instruments; PSRR(dB): -80; Supply Max(Max)(Volt): 5.5; Output Power(W): 2.8; Supply Min(Min)(Volt): 2.5; SubFamily: Dynamic Speaker; PackageReference: RTJ0020D; ComponentLink3Description: Package Specification; ComponentLink1URL: http://www.ti.com/; ComponentLink2Description: Datasheet; Eco-Plan: Green (RoHS & no Sb/Br); ComponentLink1Description: Manufacturer URL; Speaker Channels: Stereo; Special Features: AGC/DRC; DatasheetVersion: SLOS524D; Speaker Amp Type: Class-D; PackageVersion: 4205505/F, 07/2011; PackageDescription: 20-pin Plastic Flat Pack, Body 4 x 4 mm, Pitch 0.5 mm; ComponentLink3URL: http://www.ti.com/litv/pdf/mpqf156e; Mounting Technology: Surface Mount; ComponentLink2URL: http://www.ti.com/general/docs/lit/getliterature.tsp?genericPartNumber=TPA2016D2&fileType=pdf; PartNumber: TPA2016D2RTJR
C44 C47-C51 = CMP-2100-03644-1: as C19 on sheet DAC To LP Filter; Package Description: 2-Pin Surface Mount Device, Body 2 x 1.25 mm; Manufacturer URL: http://www.murata.com/; Case Code (Imperial): 0805; Datasheet URL: http://psearch.en.murata.com/capacitor/product/GRM21BR71H104KA01%23.pdf; Termination: SMD/SMT; Lead Free: LeadFree; Package Quantity: 1; Mount: SurfaceMount; REACH SVHC: Unknown; Thickness: 0.053inch; Height: 1.25mm; Case/Package: 0805; Voltage Rating: 50V; Width: 0.049inch; Case Code (Metric): 2012; Material: Ceramic; Min Operating Temperature: -55degC; RoHSCompliant: true; Datasheet Version: 42675.0; Voltage Rating (DC): 50V; Tolerance: 10%; Package Reference: 0805; Depth: 1.25mm; Length: 2mm; Max Operating Temperature: 125degC; Packaging: TapeandReel; Number of Pins: 2; Radiation Hardening: No
C45 = CMP-1036-04746-2: as C20 on sheet DAC To LP Filter
C46 C53 C54 = CMP-2007-03243-2: as C21 on sheet DAC To LP Filter; Device Class L2: Capacitors; Device Class L1: Passive Components; ComponentLink2URL: https://content.kemet.com/datasheets/KEM_C1006_X5R_SMD.pdf; Height: 1.4mm; Lead Free: Yes; Digikey Description: CAP CER 10UF 10V X5R 0805; Octopart: https://octopart.com/c0805c106k8pactu-kemet-98697; Capacitance: 10uF; Value: 10uF; Temperature Range Low: -55°C; Temperature: -55°C to +85°C; Automotive: No; Mouser Description: CAP CER 10UF 10V X5R 0805; Ipc Land Pattern Name: CAPC200125X125; Temperature Range High: +85°C; Voltage: 10V; RoHS: TRUE; Device Class L3: Ceramic Capacitors; ComponentLink2Description: Datasheet; Voltage Rating: 10V; Package: C0805C-DG; Temperature Characteristic: X5R; Category: Cap
C52 = CMP-05427-000639-1: Aluminum Electrolytic Capacitors (Radial Lead Type) AEC-Q200 Qualified 470uF ±20% 25V; Dielectric Material: Aluminium; Leakage Current: 3uA; ESR (Equivalent Series Resistance): 68mR; Lead Diameter: 0.6mm; Ripple Current: 1.05A; Life (Hours): 3000Hour; Termination: Radial; Length: 16mm; RoHS Compliant: Yes; Series: FC; Tolerance: 20%; Package Quantity: 200; Radiation Hardening: No; Case/Package: Radial; Voltage Rating: 25V; Voltage: 25V; Contact Plating: Tin; Construction: RADIAL; Max Operating Temperature: 105°C; Min Operating Temperature: -55°C; REACH SVHC: No SVHC; Height: 16mm; Ratings: AEC-Q200; Packaging: Bulk; Mount: Through Hole; Diameter: 10mm; Capacitance: 470uF; Impedance: 68mR; Height - Seated (Max): 0.63inch; Lead Free: Lead Free; Ripple Current (AC): 1.05A; Voltage Rating (DC): 25V; Lead Pitch: 5mm; Size: 16mm
O7 = CMP-1310-00252-1: as O2 on sheet DAC To LP Filter; PackageVersion: Rev. AK, 02/2011; ComponentLink2URL: http://www.onsemi.cn/pub_link/Collateral/NE5532-D.PDF; RoHS: TRUE; PackageReference: SOIC-8-751-07; ComponentLink2Description: Datasheet; PackageDescription: 8-Pin Small Outline Integrated Circuit, Body 4.9 x 3.9 mm, Pitch 1.27 mm; ComponentLink3URL: http://www.onsemi.com/pub_link/Collateral/751-07.PDF; ComponentLink1Description: Manufacturer URL; DatasheetVersion: Rev. 2; Packing: Tape and Reel; ComponentLink1URL: http://www.onsemi.com/; ComponentLink3Description: Package Specification; Mounting Technology: Surface Mount
R31 = CMP-2001-03748-2: RES Thick Film, 280Ω, 1%, 0.125W, 100ppm/°C, 0805; Power Rating: 125mW; Resistance: 280R; Voltage Rating (DC): 150V; Composition: Thick Film; Radiation Hardening: No; Width: 1.25mm; Lead Free: Lead Free; Depth: 1.25mm; Case Code (Imperial): 0805; Packaging: Tape and Reel; Weight: 0.000194oz; Number of Terminations: 2; Military Standard: Not; Contact Plating: Tin; Package Quantity: 10; Voltage Rating: 150V; Tolerance: 1%; Max Operating Temperature: 155°C; Case Code (Metric): 2012; Max Power Dissipation: 125mW; Temperature Coefficient: 100ppm/°C; Case/Package: 0805; Length: 2mm; Termination: SMD/SMT; Min Operating Temperature: -55°C; Height: 0.02inch; Features: Automotive AEC-Q200
R32-R35 = CMP-2001-00410-1: Part Number: ERJ-6GEYJ393V; Manufacturer: Panasonic
R36 = CMP-2100-03668-5: as R21 on sheet Mixer to Low Pass Filter; Package Quantity: 1; Case/Package: 0805; Lead Pitch: 0.4mm; Case Code (Imperial): 0805; Construction: Rectangular; Number of Terminations: 2; RoHS Compliant: Yes; Max Power Dissipation: 125mW; Tolerance: 1%; Max Operating Temperature: 155°C; Resistance Tolerance: 1%; Lead Free: Lead Free; Packaging: Tape and Reel; Resistor Type: Thick Film; Min Operating Temperature: -55°C; Case Code (Metric): 2012; Series: RC; Technology: THICK FILM; Voltage Rating: 150V; Termination: SMD/SMT; Width: 0.049inch; Number of Pins: 2; Features: Moisture Resistant; Military Standard: Not; Length: 0.079inch; Depth: 1.25mm; Size Code: 0805; Height: 0.024inch
S1 S2 = CMP-2000-05888-3: CONN HEADER VERT 2POS 2.5MM; Current Rating: 3A; Voltage Rating: 250V; Number of Contacts: 2; Contact Resistance: 20mR; Wire/Cable Gauge: 22AWG; Insulation Resistance: 1GR; Connector Type: Male Pin; Packaging: Bulk; Contact Material: Brass; Lead Free: Lead Free; Orientation: Straight; Contact Plating: Tin; Max Current Rating: 3A; Termination: Solder; Fastening Type: Detent; Depth: 5.75mm; Housing Material: Polyamide; REACH SVHC: No SVHC; Series: XH; Voltage Rating (AC): 250V; Number of Positions: 2; Color: Natural; Contact Type: Male Pin; Max Voltage Rating (DC): 250V; Pitch: 2.5mm; Lead Pitch: 2.5mm; Mount: Through Hole; Max Operating Temperature: 85°C; Length: 7.4mm; Max Voltage Rating (AC): 250V; Min Operating Temperature: -25°C; Number of Rows: 1; Housing Color: White

## Nets that join several sheets
+5: DAC To LP Filter (7 pins), Mixer to Low Pass Filter (7 pins), High Pass Filter (7 pins), Amplifier-LM386 (Amp1.6), Amplifier-TPA2016D2 (15 pins)
GND: DAC To LP Filter (10 pins), Mixer to Low Pass Filter (9 pins), High Pass Filter (9 pins), Amplifier-LM386 (12 pins), Amplifier-TPA2016D2 (12 pins)
NetAudio_Jack_3: Amplifier-LM386 (Audio_Jack.3 Audio_Jack.4), Amplifier-TPA2016D2 (R31.1)
NetC30_2: Mixer to Low Pass Filter (O4.6 O4.7), High Pass Filter (C30.2 O5.5)
NetO2_1: DAC To LP Filter (O2.1 O2.2), Mixer to Low Pass Filter (R20.1)
NetO6_6: High Pass Filter (O6.6 O6.7), Amplifier-LM386 (R25.2)